# Altium schematic sheet Controller Watchdog.SchDoc: Modular Parent Motherboard
size Letter; DrawnBy: MTAN; Organization: Altium Limited; DocumentNumber: 6; Revision: B; SheetNumber: 6; SheetTotal: 6
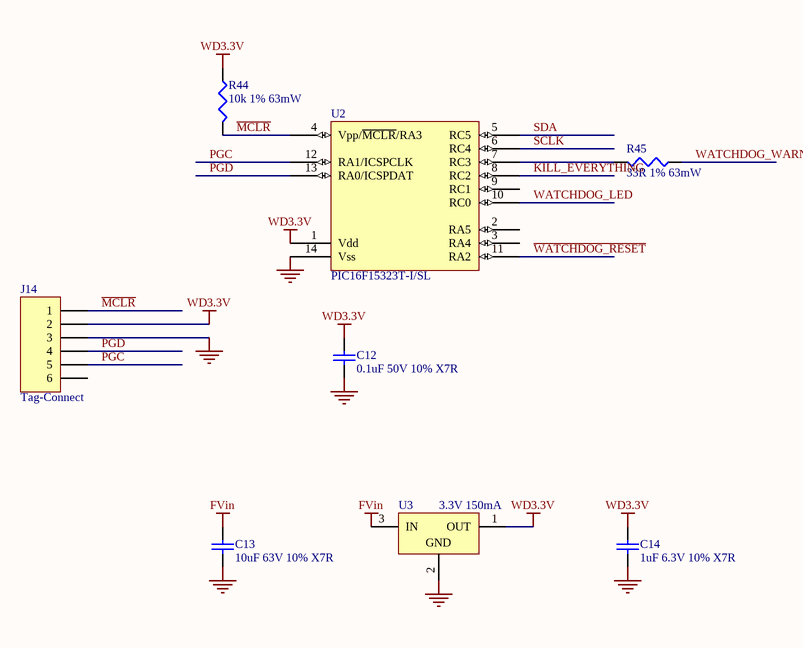
[diagram p0: Controller Watchdog.SchDoc]

## Parts
C12  0.1uF 50V 10% X7R  [CAPC1005L]
C13  10uF 63V 10% X7R  [C1210_L]
C14  1uF 6.3V 10% X7R  [CAPC1005L]
J14  Tag-Connect  [TC2030-MCP]
R44  10k 1% 63mW  [RESC1005L]
R45  33R 1% 63mW  [RESC1005L]
U2  PIC16F15323T-I/SL  [14SOP_L]
U3  3.3V 150mA  [SOT89L]

## Nets
FVin: C13.2 U3.3(IN)
GND: C12.2 C13.1 C14.2 J14.3 U2.14(Vss) U3.2(GND)
WD3.3V: C12.1 C14.1 J14.2 R44.1 U2.1(Vdd) U3.1(OUT)
KILL_EVERYTHING: U2.8(RC2)
~{MCLR}: J14.1 R44.2 U2.4(Vpp/~{MCLR}/RA3)
PGC: J14.5 U2.12(RA1/ICSPCLK)
PGD: J14.4 U2.13(RA0/ICSPDAT)
SCLK: U2.6(RC4)
SDA: U2.5(RC5)
~{WATCHDOG_RESET}: U2.11(RA2)
WATCHDOG_LED: U2.10(RC0)
WATCHDOG_WARN: R45.2
NetR45_1: R45.1 U2.7(RC3)

Not connected (* = marked no-connect by the designer): J14 6; U2 2(RA5) 3(RA4) 9(RC1)

## Notes on the sheet
- Title
- Drawn By:
- Date:
- Time:
- Revision:
- Sheet
- of
- The Latium Group of Companies
- 1312 10 Street
- Nisku, Alberta
- T9E 8K2
- Canada
- File:

## Library data of the parts
C12-C14 = Cap: Capacitor
  C12: Value: 0.1uF 50V 10% X7R
  C13: Value: 10uF 63V 10% X7R
  C14: Value: 1uF 6.3V 10% X7R
J14 = Header 6: Tag Connect Programming Header; Value: Tag-Connect
R44 R45 = Res3: Resistor
  R44: Value: 10k 1% 63mW
  R45: Value: 33R 1% 63mW
U2 = PIC16F15323: IC MCU 8BIT 3.5KB FLASH 14SOIC; Manufacturer: Microchip Technology; Value: PIC16F15323T-I/SL; Manufacturer Part Number: PIC16F15323T-I/SL; Supplier 1: Digi-Key; Supplier 1 Part Number: PIC16F15323T-I/SLCT-ND
U3 = LP2954AIT: IC REG LINEAR 3.3V 150MA SOT89; Manufacturer Part Number: AP7381-33Y-13; Manufacturer: Diodes Incorporated; Value: 3.3V 150mA; Supplier 1: Digi-Key; Supplier 1 Part Number: AP7381-33Y-13DICT-ND